# EAGLE design PIR Circuit (EAGLE 8.3.1)
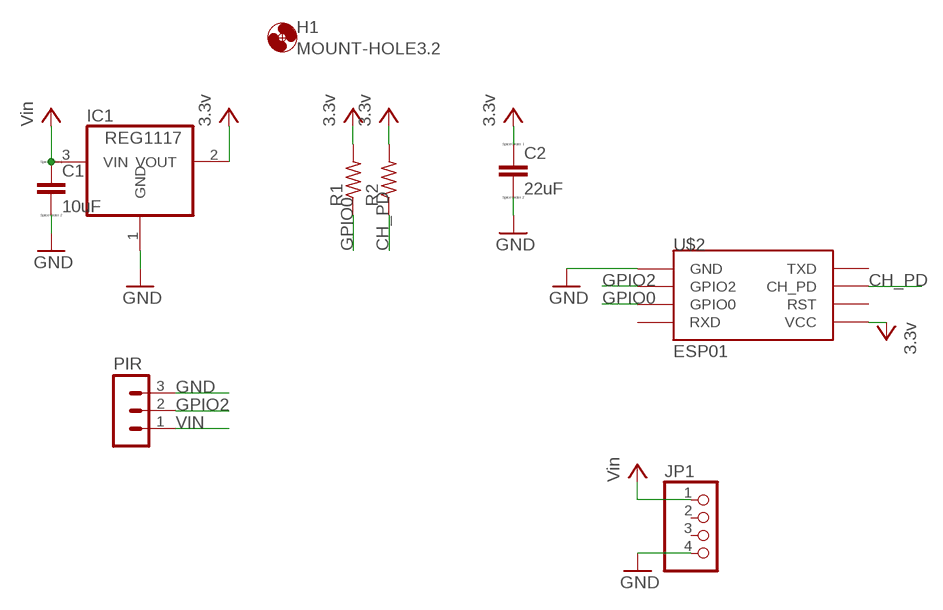
[diagram p0: schematic, sheet 1]

## Parts
C1  10uF  C  [C0805]
C2  22uF  C  [C0805]
H1  MOUNT-HOLE3.2  [3,2]
IC1  REG1117  [SOT223]
JP1  PINHD-1X4/90  [1X04/90]
PIR  MA03-1  [MA03-1]
R1  R-US_M1206  [M1206]
R2  R-US_M1206  [M1206]
U$2  ESP01  [ESP01]

## Nets
3.3V: C2.1 IC1.2(VOUT) R1.2 R2.2 U$2.VCC ; supply symbol labelled 3.3v
CH_PD: R2.1 U$2.CH_PD
GND: C1.2 C2.2 IC1.1(GND) JP1.4 PIR.3 U$2.GND
GPIO0: R1.1 U$2.GPIO0
GPIO2: PIR.2 U$2.GPIO2
VIN: C1.1 IC1.3(VIN) JP1.1 PIR.1 ; supply symbol labelled Vin
Unconnected: JP1.2 JP1.3 U$2.RST U$2.RX(RXD) U$2.TX(TXD)

## Library data of the parts
C1 C2 = eagle-ltspice:C: CAPACITOR, European symbol; SPICEMODEL: NONE; SPICEPREFIX: C
H1 = holes:MOUNT-HOLE: MOUNTING HOLE with drill center marker
IC1 = burr-brown:REG1117: 800mA and 1A Low Dropout (LDO) Positive Regulator 1.8V, 2.5V, 2.85V, 3.3V, 5V, and Adj; MPN: REG1117; OC_FARNELL: 1097566; OC_NEWARK: 14P6981
JP1 = pinhead:PINHD-1X4: PIN HEADER
PIR = con-lstb:MA03-1: PIN HEADER; OC_FARNELL: unknown; OC_NEWARK: unknown
R1 R2 = resistor:R-US_: RESISTOR, American symbol
U$2 = esp8266modules:ESP01: ESP8266 Wifi module 01

## Board
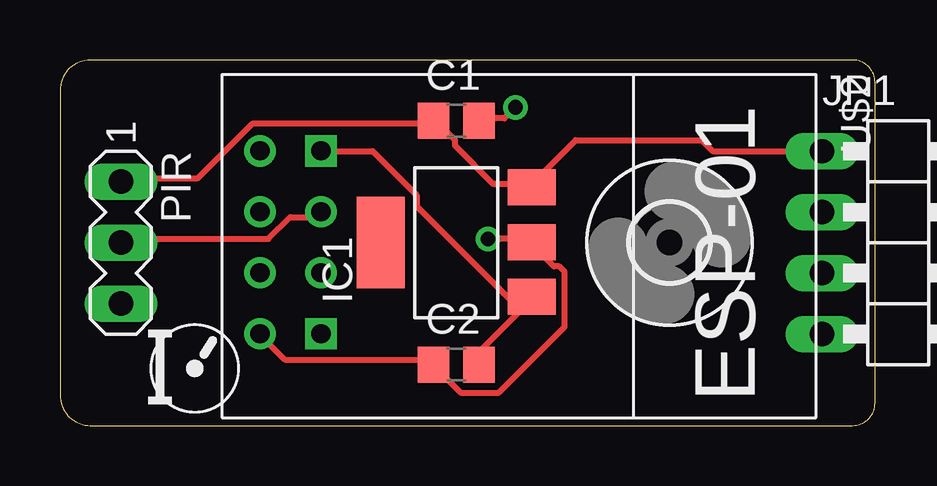
[diagram p1: board, top side]
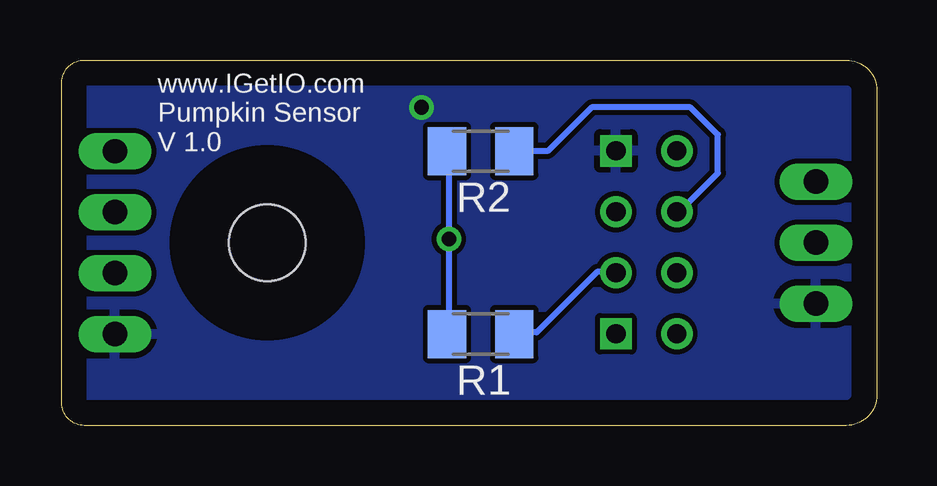
[diagram p2: board, bottom side, seen from below]

Size 33.96 x 15.23 mm. Coordinates in mm from the lower left corner, seen from the top.
Outline: 1.27,0 33.02,0 arc90 33.96,0.94 33.96,14.29 arc90 33.02,15.23 1.27,15.23 arc90 0,13.96 0,1.27 arc90 1.27,0
Copper layers (1*16): Top 0.035mm / dielectric 1.5mm / Bottom 0.035mm
Design rules "default": minimum track width 10mil, minimum drill 24mil, track to track 8mil, track to pad 8mil, pad to pad 8mil, via to via 8mil, smd to smd 8mil, copper to edge 40mil, drill to drill 8mil, minimum pad ring 10mil, minimum via ring 8mil, stop-mask expansion 4mil, vias tented up to drill 0mil, thermal gap 10mil

### Footprints (pad centres in the part's own frame; a part is rotated, then mirrored left to right if it is on the bottom)
C0805 = smd 1.3 x 1.5: 1 -0.95,0; 2 0.95,0
3,2 = hole 3.2: 0,0
SOT223 = smd 1.499 x 2.007: 1 -2.261,-3.15; 2 0.025,-3.15; 3 2.311,-3.15 | smd 3.81 x 2.007: 4 0,3.15
1X04/90 = drill 1.016 long: 1 -3.81,-3.81; 2 -1.27,-3.81; 3 1.27,-3.81; 4 3.81,-3.81
MA03-1 = drill 1.016 long: 1 -2.54,0; 2 0,0; 3 2.54,0
M1206 = smd 1.6 x 2: 1 -1.4,0; 2 1.4,0
ESP01 = drill 0.8: CH_PD -1.285,-8.178; GPIO0 1.255,-5.638; GPIO2 -1.285,-5.638; RST 1.255,-8.178; TX -3.825,-8.178; VCC 3.795,-8.178 | drill 0.8 square: GND -3.825,-5.638; RX 3.795,-5.638

### Placement (x,y rotation side)
C1  16.51,12.7 0 top
C2  16.51,2.54 0 top
H1  25.4,7.62 0 top
IC1  16.51,7.62 90 top
JP1  35.56,7.62 270 top
PIR  2.54,7.62 270 top
R1  16.51,3.81 180 bottom
R2  16.51,11.43 180 bottom
U$1  [IGETIO-0.25]  3.68,0.51 0 top
U$2  16.51,7.62 270 top

### Tracks (layer width: path | path; a pad name or v marks a point on that pad's centre or on a via)
3.3V  (via drill 0.61)
  Top 0.254: U$2.VCC 8.46,3.66 9.37,2.74 15.54,2.74 C2.1 15.54,2.52 16.69,1.37 18.29,1.37 21.03,4.12 21.03,6.4 20.8,6.63 20.57,6.63 19.66,7.54 IC1.2 19.66,7.77 v17.83,7.77
  Bottom 0.254: R1.2 17.83,3.89 v17.83,7.77 17.83,11.43 R2.2
CH_PD
  Bottom 0.254: R2.1 13.72,11.43 11.89,13.26 7.77,13.26 6.63,12.12 6.63,10.52 8.23,8.91 U$2.CH_PD
GND  (via drill 0.61)
  Top 0.254: 19.2,4.8 19.66,5.26 IC1.1 19.2,4.8 | 19.2,4.8 17.6,3.2 17.6,2.74 C2.2 | 19.2,4.8 14.86,9.14 14.86,9.6 13.03,11.43 10.97,11.43 U$2.GND | v18.97,13.26 18.52,12.8 17.6,12.8 C1.2
  pour Bottom: 1.27,13.97 1.27,1.27 33.02,1.27 33.02,13.97
GPIO0
  Bottom 0.254: R1.1 15.09,3.89 14.17,3.89 11.66,6.4 10.97,6.4 U$2.GPIO0
GPIO2
  Top 0.254: U$2.GPIO2 10.74,8.69 9.6,8.69 8.69,7.77 2.74,7.77 PIR.2
VIN
  Top 0.254: 19.66,10.06 18.06,10.06 16.46,11.66 16.46,11.89 15.77,12.57 C1.1 15.54,12.57 8,12.57 5.71,10.29 2.74,10.29 PIR.1 | JP1.1 27.2,11.43 26.75,11.89 21.49,11.89 19.66,10.06 | 19.66,10.06 IC1.3

### Text on the board
bPlace: www.IGetIO.com / Pumpkin Sensor / V 1.0